# Altium schematic sheet RPE_Schematic.SchDoc
size A4; SheetNumber: 1; SheetTotal: 1
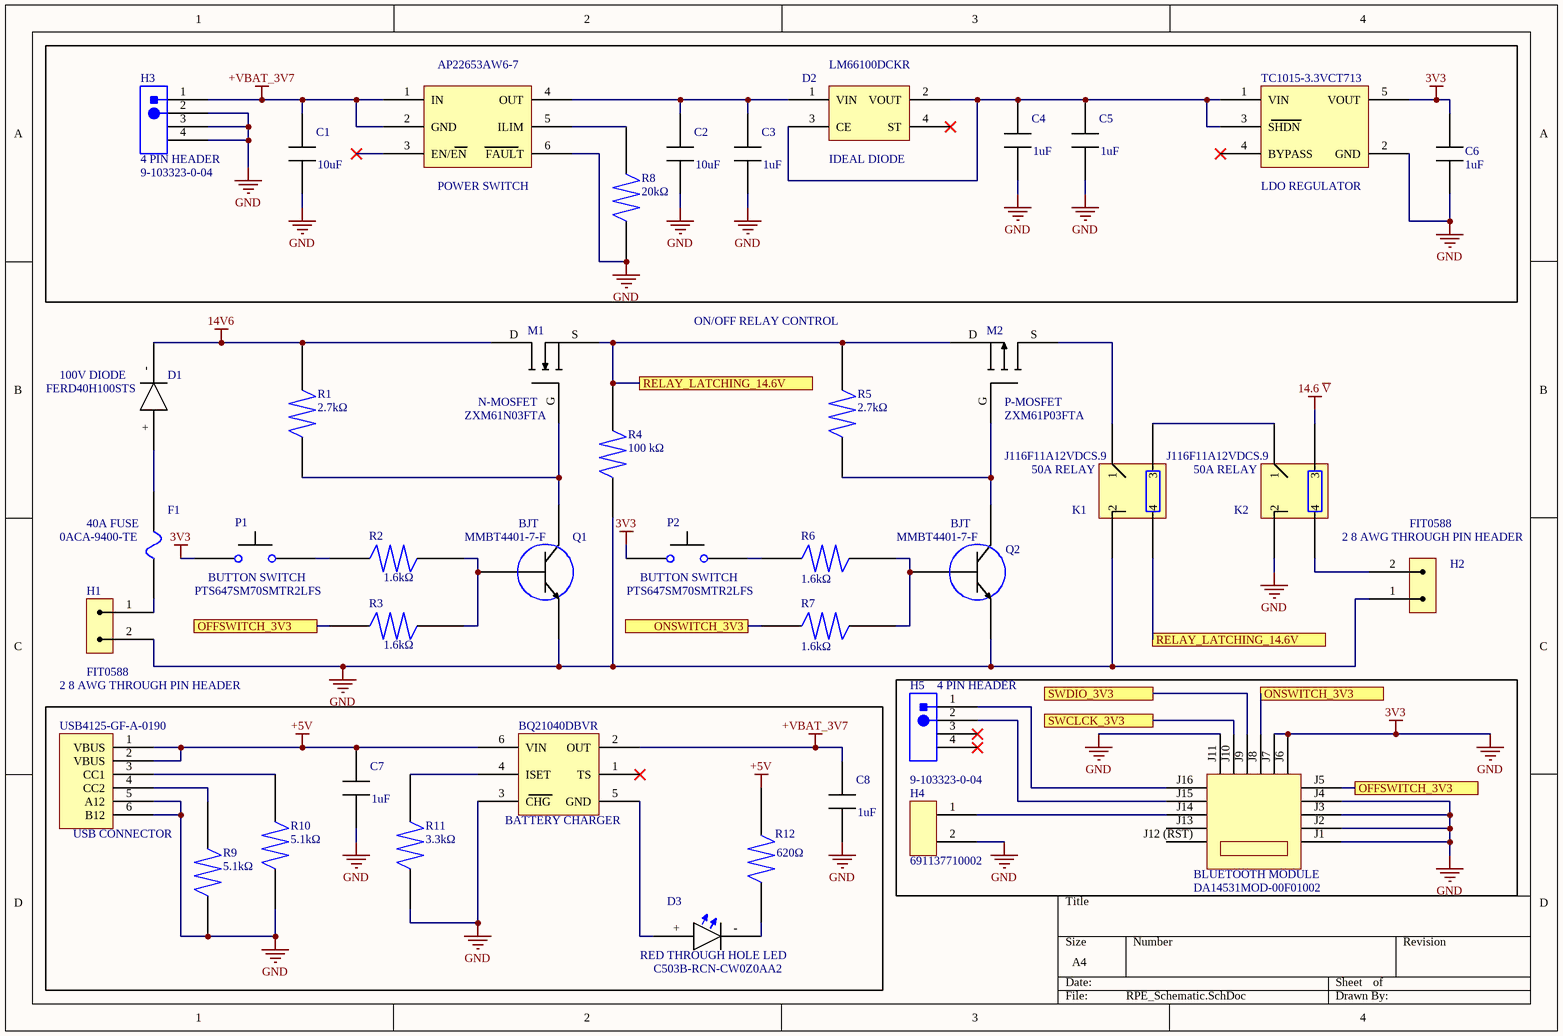
[diagram p0: RPE_Schematic.SchDoc]

## Parts
*  POWER SWITCH
BC  BATTERY CHARGER
BT  BLUETOOTH MODULE
C1  value 10uF  (hidden comment: GRM188D71A106MA73J)
C2  value 10uF  (hidden comment: GRM188D71A106MA73J)
C3  value 1uF  (hidden comment: 1 uF Capacitor)
C4  value 1uF  (hidden comment: 1 uF Capacitor)
C5  value 1uF  (hidden comment: 1 uF Capacitor)
C6  value 1uF  (hidden comment: 1 uF Capacitor)
C7  value 1uF  (hidden comment: 1 uF Capacitor)
C8  value 1uF  (hidden comment: 1 uF Capacitor)
D1  100V DIODE
D2  IDEAL DIODE
D3  RED THROUGH HOLE LED
F1  40A FUSE
H1  2 8 AWG THROUGH PIN HEADER
H2  2 8 AWG THROUGH PIN HEADER
H3  4 PIN HEADER
H4  691137710002
H5  4 PIN HEADER
K1  50A RELAY
K2  50A RELAY
LDO  LDO REGULATOR
M1  N-MOSFET
M2  P-MOSFET
P1  BUTTON SWITCH
P2  BUTTON SWITCH
Q1  BJT
Q2  BJT
R1  value 2.7kΩ  (hidden comment: CR0603-FX-2701ELF)
R2  value 1.6kΩ  (hidden comment: SG73P1JTTD1601F)
R3  value 1.6kΩ  (hidden comment: SG73P1JTTD1601F)
R4  100 kΩ
R5  value 2.7kΩ  (hidden comment: CR0603-FX-2701ELF)
R6  value 1.6kΩ  (hidden comment: SG73P1JTTD1601F)
R7  value 1.6kΩ  (hidden comment: SG73P1JTTD1601F)
R8  value 20kΩ  (hidden comment: NRC06F2002TRF)
R9  value 5.1kΩ  (hidden comment: RC0402FR-135K1L)
R10  value 5.1kΩ  (hidden comment: RC0402FR-135K1L)
R11  value 3.3kΩ  (hidden comment: Chip Resistor)
R12  value 620Ω  (hidden comment: RMCF0603FT620R)
U1  USB CONNECTOR

## Ports
OFFSWITCH_3V3 (see RPE_Schematic(Needs more slay)[1C]), OFFSWITCH_3V3 (see RPE_Schematic(Needs more slay)[4D]), ONSWITCH_3V3 (see RPE_Schematic(Needs more slay)[2C]), ONSWITCH_3V3 (see RPE_Schematic(Needs more slay)[4C]), RELAY_LATCHING_14.6V (see RPE_Schematic(Needs more slay)[2B]), RELAY_LATCHING_14.6V (see RPE_Schematic(Needs more slay)[3C]), SWCLCK_3V3, SWDIO_3V3

## Nets
3V3: *.6(FAULT) BC.3(CHG) BT.J1 BT.J2 BT.J3 BT.J4 BT.J6 BT.J7 BT.J11 C1.1 C2.1 C3.1 C4.1 C5.1 C6.1 C6.2 C7.1 C8.1 H1.2 H2.1 H3.2 H3.3 H3.4 H4.2 K1.?2(2) K2.?2(2) LDO.2(GND) LDO.5(VOUT) P1.?1 P2.?1 Q1.?3 Q2.?3 R4.1 R8.1 R9.1 R10.1 R11.1 U1.5(A12) U1.6(B12)  [also labelled GND]
14.6 ~{V}: K2.?4(3)
14V6: D1.- M1.D R1.?1
+5V: BC.6(VIN) C7.2 R12.2 U1.1(VBUS) U1.2(VBUS)
+VBAT_3V7: *.1(IN) *.2(GND) BC.2(OUT) C1.2 C8.2 H3.1
OFFSWITCH_3V3: BT.J5 R3.1 ; port OFFSWITCH_3V3
ONSWITCH_3V3: BT.J8 R7.1 ; port ONSWITCH_3V3
RELAY_LATCHING_14.6V: K1.?3(4) M1.S M2.D R4.?1 R5.?1 ; port RELAY_LATCHING_14.6V
SWCLCK_3V3: BT.J10 ; port SWCLCK_3V3
SWDIO_3V3: BT.J9 ; port SWDIO_3V3
Net*_4: *.4(OUT) C2.2 C3.2 D2.1(VIN)
Net*_5: *.5(ILIM) R8.2
NetBC_4: BC.4(ISET) R11.2
NetBC_5: BC.5(GND) D3.+
NetBT_J14: BT.J14 H4.1
NetBT_J15: BT.J15 H5.2
NetBT_J16: BT.J16 H5.1
NetC4_2: C4.2 C5.2 D2.2(VOUT) D2.3(CE) LDO.1(VIN) LDO.3(SHDN)
NetD1_+: D1.+ F1.?2
NetD3_-: D3.- R12.1
NetF1_?1: F1.?1 H1.1
NetH2_2: H2.2 K2.?3(4)
NetK1_?1: K1.?1(1) M2.S
NetK1_?4: K1.?4(3) K2.?1(1)
NetM1_G: M1.G Q1.?2 R1.1
NetM2_G: M2.G Q2.?2 R5.1
NetP1_?2: P1.?2 R2.1
NetP2_?2: P2.?2 R6.1
NetQ1_?1: Q1.?1 R2.?1 R3.?1
NetQ2_?1: Q2.?1 R6.?1 R7.?1
NetR9_2: R9.2 U1.4(CC2)
NetR10_2: R10.2 U1.3(CC1)

Not connected (* = marked no-connect by the designer): * 3(EN/EN)*; BC 1(TS)*; BT J12 (RST) J13; D2 4(ST)*; H5 3* 4*; LDO 4(BYPASS)*

## Notes on the sheet
- ON/OFF RELAY CONTROL

## Library data of the parts
* = AP22653AW6-7: PRECISION ADJUSTABLE CURRENT-LIMITED POWER SWITCHES, -40 to 85°C pF, RoHS; Manufacturer: Diodes; Number of Channels: 1NUMBER; Supplier: Digikey; Supplier Part Number: 31-AP22653AW6-7CT-ND; RoHS: Yes; Category: USB Interface ICs; Stock: 404154; Pricing: 1=0.44, 10=0.378, 25=0.3524, 100=0.282, 250=0.2618, 500=0.22154, 1000=0.17118 (USD); ComponentLink1URL: https://www.diodes.com/assets/Datasheets/AP22652_53_52A_53A.pdf?src-supplier=Digikey; ComponentLink1Description: https://www.diodes.com/assets/Datasheets/AP22652_53_52A_53A.pdf?src-supplier=Digikey; Manufacturer Part Number: AP22653AW6-7
BC = BQ21040DBVR: IC BAT CHG LI-ION 1 CELL SOT23-6; Manufacturer: Texas Instruments; Number of Cells: 1; Fault Protection: Over Voltage,Over Temperature,Short Circuit; Interface: USB; Max Charge Current: 800mA; Battery Pack Voltage: 4.2V; Max Supply Voltage: 6.45V; Supplier: Digikey; Supplier Part Number: 296-47315-6-ND; RoHS: Yes; Category: Battery Management; Stock: 1140; Pricing: 1=0.89, 10=0.78, 25=0.7328, 100=0.5979, 250=0.5554, 500=0.47268, 1000=0.37814 (USD); Mounting Technology: Surface Mount; Case/Package: SOT-23-6; Min Operating Temperature: 0°C; Max Operating Temperature: 125°C; Packaging: Cut Tape; Series: -; Lead Free: Lead Free; RoHS Compliant: Yes; ComponentLink1URL: http://www.ti.com/lit/ds/symlink/bq21040.pdf?src-supplier=Digikey; ComponentLink1Description: http://www.ti.com/lit/ds/symlink/bq21040.pdf?src-supplier=Digikey; ComponentLink2URL: http://www.ti.com/general/docs/suppproductinfo.tsp?distId=10&gotoUrl=http%3A%2F%2Fwww.ti.com%2Flit%2Fgpn%2Fbq21040&src-supplier=Digikey; ComponentLink2Description: http://www.ti.com/general/docs/suppproductinfo.tsp?distId=10&gotoUrl=http%3A%2F%2Fwww.ti.com%2Flit%2Fgpn%2Fbq21040&src-supplier=Digikey; ComponentLink3URL: http://www.ti.com/general/docs/suppproductinfo.tsp?distId=10&amp;gotoUrl=http%3A%2F%2Fwww.ti.com%2Flit%2Fgpn%2Fbq21040&src-supplier=Digikey; ComponentLink3Description: http://www.ti.com/general/docs/suppproductinfo.tsp?distId=10&amp;gotoUrl=http%3A%2F%2Fwww.ti.com%2Flit%2Fgpn%2Fbq21040&src-supplier=Digikey; Manufacturer Part Number: BQ21040DBVR
BT = DA14531MOD-00F01002: Bluetooth Module, 1MBPS, Bluetooth 5.1 Rohs Compliant: Yes; Manufacturer: Renesas; Supplier: Digikey; Supplier Part Number: 1695-DA14531MOD-00F01002CT-ND; RoHS: No; Category: RF Receivers, Transceivers; Stock: 218621; Pricing: 1=5.66, 10=5.05, 25=4.5448, 100=4.141, 250=3.737, 500=3.3532 (USD); ComponentLink1URL: https://datasheet.octopart.com/DA14531MOD-00F01002-Dialog-Semiconductor-datasheet-153441348.pdf?src-supplier=Farnell; ComponentLink1Description: https://datasheet.octopart.com/DA14531MOD-00F01002-Dialog-Semiconductor-datasheet-153441348.pdf?src-supplier=Farnell; ComponentLink2URL: https://datasheet.octopart.com/DA14531MOD-00F01002-Renesas-datasheet-169923465.pdf?src-supplier=Future+Electronics; ComponentLink2Description: https://datasheet.octopart.com/DA14531MOD-00F01002-Renesas-datasheet-169923465.pdf?src-supplier=Future+Electronics; Manufacturer Part Number: DA14531MOD-00F01002
C1 C2 = GRM188D71A106MA73J: Cap 10UF 10VDC X7T 20% SMD 0603 Paper Tape; Manufacturer: Murata; Voltage Rating: 10V; Supplier: Digikey; Supplier Part Number: 490-GRM188D71A106MA73JCT-ND; Manufacturer Part Number: GRM188D71A106MA73J; RoHS: Yes; Category: Ceramic Capacitors; Stock: 9799; Pricing: 1=0.3, 10=0.197, 50=0.145, 100=0.118, 500=0.09316, 1000=0.07867, 2500=0.07453, 5000=0.07039 (USD); Mounting Technology: Surface Mount; Case/Package: 0603; Weight: 0.000222oz; Min Operating Temperature: -55°C; Max Operating Temperature: 125°C; Packaging: Tape and Reel; Tolerance: 20%; Package Quantity: 10000; Dielectric: X7T; Voltage Rating (DC): 10V; Series: GRM; RoHS Compliant: Yes; ComponentLink1URL: http://www.mouser.com/ds/2/281/c02e-2905.pdf?src-supplier=Mouser; ComponentLink1Description: http://www.mouser.com/ds/2/281/c02e-2905.pdf?src-supplier=Mouser; ComponentLink2URL: http://search.murata.co.jp/Ceramy/image/img/A01X/partnumbering_e_01.pdf?src-supplier=Digikey; ComponentLink2Description: http://search.murata.co.jp/Ceramy/image/img/A01X/partnumbering_e_01.pdf?src-supplier=Digikey
C3-C8 = CL10B105MO8NNWC: SMD Multilayer Ceramic Capacitor, 1 µF, 16 V, 0603 [1608 Metric], ± 20%, X7R, CL Series; Manufacturer: Samsung; Material: 4241ConductorMaterial; Voltage Rating: 16V; Dielectric: 1511DielectricType; Supplier: Digikey; Supplier Part Number: 1276-6524-1-ND; Manufacturer Part Number: CL10B105MO8NNWC; RoHS: Yes; Category: Ceramic Capacitors; Stock: 1284189; Pricing: 1=0.1, 10=0.034, 50=0.0196, 100=0.0152, 500=0.01142, 1000=0.00897 (USD); Mounting Technology: Surface Mount; Case/Package: 0603; Case Code (Metric): 1608; Case Code (Imperial): 0603; Min Operating Temperature: -55°C; Max Operating Temperature: 125°C; Packaging: Cut Tape; Tolerance: 20%; Series: CL; Voltage Rating (DC): 16V; Length: 0.063inch; Width: 0.031inch; Height: 900um; Thickness: 0.035inch; RoHS Compliant: Yes; ComponentLink1URL: https://media.digikey.com/pdf/Data%20Sheets/Samsung%20PDFs/CL10B105MO8NNWC.pdf?src-supplier=Digikey; ComponentLink1Description: https://media.digikey.com/pdf/Data%20Sheets/Samsung%20PDFs/CL10B105MO8NNWC.pdf?src-supplier=Digikey; ComponentLink2URL: http://www.farnell.com/datasheets/2710574.pdf?src-supplier=Farnell; ComponentLink2Description: http://www.farnell.com/datasheets/2710574.pdf?src-supplier=Farnell; ComponentLink3URL: https://datasheet.octopart.com/CL10B105MO8NNWC-Samsung-Electro-Mechanics-datasheet-120079234.pdf?src-supplier=Future+Electronics; ComponentLink3Description: https://datasheet.octopart.com/CL10B105MO8NNWC-Samsung-Electro-Mechanics-datasheet-120079234.pdf?src-supplier=Future+Electronics; ComponentLink4URL: http://www.farnell.com/datasheets/2710574.pdf?src-supplier=Newark; ComponentLink4Description: http://www.farnell.com/datasheets/2710574.pdf?src-supplier=Newark; ComponentLink5URL: http://www.farnell.com/datasheets/2710574.pdf?src-supplier=Element14; ComponentLink5Description: http://www.farnell.com/datasheets/2710574.pdf?src-supplier=Element14
D1 = FERD40H100STS: FERD40H100 Series 100 V 40 A Field Effect Rectifier Diode - TO-220AB; Manufacturer: STMicroelectronics; Average Rectified Current: 40A; Supplier: Digikey; Supplier Part Number: 497-16954-ND; RoHS: Yes; Category: Rectifier Diodes; Stock: 1657; Pricing: 1=1.4, 50=1.1266, 100=0.8927, 500=0.7567, 1000=0.61641, 2000=0.58028, 5000=0.55264, 10000=0.52714 (USD); Mounting Technology: Through Hole; Case/Package: TO-220-3; Packaging: Rail/Tube; Max Reverse Voltage (DC): 100V; Series: -; Diode Type: RECTIFIER; RoHS Compliant: Yes; ComponentLink1URL: http://www.st.com/content/ccc/resource/technical/document/datasheet/group3/4e/b5/b8/47/b6/af/41/d6/DM00281757/files/DM00281757.pdf/jcr:content/translations/en.DM00281757.pdf?src-supplier=Digikey; ComponentLink1Description: http://www.st.com/content/ccc/resource/technical/document/datasheet/group3/4e/b5/b8/47/b6/af/41/d6/DM00281757/files/DM00281757.pdf/jcr:content/translations/en.DM00281757.pdf?src-supplier=Digikey; ComponentLink2URL: https://datasheet.octopart.com/FERD40H100STS-STMicroelectronics-datasheet-62332851.pdf?src-supplier=Future+Electronics; ComponentLink2Description: https://datasheet.octopart.com/FERD40H100STS-STMicroelectronics-datasheet-62332851.pdf?src-supplier=Future+Electronics; ComponentLink3URL: https://datasheet.octopart.com/FERD40H100STS-STMicroelectronics-datasheet-141402762.pdf?src-supplier=TME; ComponentLink3Description: https://datasheet.octopart.com/FERD40H100STS-STMicroelectronics-datasheet-141402762.pdf?src-supplier=TME; Manufacturer Part Number: FERD40H100STS
D2 = LM66100DCKR: 1.5-V to 5.5-V, 1.5-A, 0.5-uA IQ ideal diode with Integrated FET 6-SC70 -40 to 105; Manufacturer: Texas Instruments; Max Output current: 1.5A; Turn-On Delay Time: 27us; Turn-Off Delay Time: 2us; Supplier: Digikey; Supplier Part Number: 296-53541-1-ND; RoHS: Yes; Category: Integrated Circuits (ICs); Stock: 1921; Pricing: 1=0.41, 10=0.332, 25=0.304, 100=0.2262, 250=0.20504, 500=0.16968, 1000=0.12726 (USD); Mounting Technology: Surface Mount; Min Operating Temperature: -40°C; Max Operating Temperature: 105°C; Series: -; ComponentLink1URL: http://www.ti.com/general/docs/suppproductinfo.tsp?distId=10&amp;gotoUrl=http%3A%2F%2Fwww.ti.com%2Flit%2Fgpn%2flm66100&src-supplier=Digikey; ComponentLink1Description: http://www.ti.com/general/docs/suppproductinfo.tsp?distId=10&amp;gotoUrl=http%3A%2F%2Fwww.ti.com%2Flit%2Fgpn%2flm66100&src-supplier=Digikey; Manufacturer Part Number: LM66100DCKR
D3 = C503B-RCN-CW0Z0AA2: CREE - C503B-RCN-CW0Z0AA2 - LED, Red, Through Hole, T-1 3/4 (5mm), 20 mA, 2.1 V, 624 nm; Lens Color: Colorless; Luminous Intensity: 7500mcd; Viewing Angle: 30°; Forward Voltage: 2.1V; Wavelength: 624nm; Forward Current: 20mA; Lens Style: Dome,Elliptical,Round; Lens Transparency: Clear; Number of LEDs: 1; Supplier: Digikey; Supplier Part Number: C503B-RCN-CW0Z0AA2CT-ND; Manufacturer: Cree; RoHS: Yes; Category: LEDs; Stock: 49819; Pricing: 1=0.18, 10=0.167, 100=0.1548, 1000=0.139 (USD); Mounting Technology: Through Hole; Case/Package: Radial; Pins: 5; Color: Red; Min Operating Temperature: -40°C; Max Operating Temperature: 100°C; Illumination Color: Red; Package Quantity: 2500; Packaging: Cut Tape; Test Current: 20mA; Dominant Wavelength: 624nm; Series: -; Height: 10.3mm; RoHS Compliant: Yes; Reach SVHC Compliant: Unknown; ComponentLink1URL: https://datasheet.ciiva.com/8076/c503brasranaasaanrbsrbnabsabnrcsrcnacsacn1079-8076255.pdf?src-supplier=Element14; ComponentLink1Description: https://datasheet.ciiva.com/8076/c503brasranaasaanrbsrbnabsabnrcsrcnacsacn1079-8076255.pdf?src-supplier=Element14; ComponentLink2URL: https://datasheet.ciiva.com/46396/1783695-46396283.pdf?src-supplier=Element14; ComponentLink2Description: https://datasheet.ciiva.com/46396/1783695-46396283.pdf?src-supplier=Element14; ComponentLink3URL: https://datasheet.ciiva.com/2116/c503brasranaasaanrbsrbnabsabnrcsrcnacsacn1079-2116093.pdf?src-supplier=Digikey; ComponentLink3Description: https://datasheet.ciiva.com/2116/c503brasranaasaanrbsrbnabsabnrcsrcnacsacn1079-2116093.pdf?src-supplier=Digikey; Manufacturer Part Number: C503B-RCN-CW0Z0AA2
F1 = 0ACA-9400-TE: Bel Fuse, Internal Part #: 0ACA-9400-TE; Supplier: Digikey; Supplier Part Number: 507-0ACA-9400-TECT-ND; Manufacturer: Bel; RoHS: Yes; Category: Fuses; Stock: 695; Pricing: 1=1.32, 5=1.282, 10=1.199, 50=0.9926, 100=0.8272, 250=0.80652, 500=0.68244 (USD); Manufacturer Part Number: 0ACA-9400-TE
H1 H2 = FIT0588: High Quality Gold Plated Male and Female Bullet Connector; Manufacturer: DFRobot; Supplier: Digikey; Supplier Part Number: 1738-1438-ND; RoHS: No; Category: LDO; Stock: 1280; Pricing: 1=3.9 (USD); ComponentLink1URL: https://media.digikey.com/pdf/Data%20Sheets/DFRobot%20PDFs/FIT0588_Web.pdf?src-supplier=Digikey; ComponentLink1Description: https://media.digikey.com/pdf/Data%20Sheets/DFRobot%20PDFs/FIT0588_Web.pdf?src-supplier=Digikey; Manufacturer Part Number: FIT0588
H3 H5 = 9-103323-0-04: CONN HEADR BRKWAY .100 04POS R/A; Manufacturer: TE Connectivity; Number of Positions: 4; Gender: Male; Supplier: Digikey; Supplier Part Number: A32705-04-ND; RoHS: Yes; Category: Connectors; Stock: 9773; Pricing: 1=0.69, 10=0.672, 100=0.5422, 500=0.4801, 1000=0.4208, 5000=0.36714, 10000=0.34172 (USD); Mounting Technology: Through Hole; Case/Package: 100; Housing Color: Black; Contact Material: Copper Alloy; Housing Material: Plastic; Contact Shape: Square; Contact Finish - Mating: TIN; Insulation Material: Thermoplastic; Insulation Color: Black; Min Operating Temperature: -65°C; Max Operating Temperature: 105°C; Number of Rows: 1; Packaging: Bulk; Termination: Solder; Number of Contacts: 4; Series: AMPMODU MOD II; Contact Type: Male Pin; Fastening Type: Pull; Length: 9.75mm; Width: 2.29mm; Height: 3.5mm; Lead Free: Lead Free; Flammability Rating: UL94 V-0; ComponentLink1URL: http://www.te.com/commerce/DocumentDelivery/DDEController?Action=srchrtrv&DocNm=103323&DocType=Customer+Drawing&DocLang=English&src-supplier=Digikey; ComponentLink1Description: http://www.te.com/commerce/DocumentDelivery/DDEController?Action=srchrtrv&DocNm=103323&DocType=Customer+Drawing&DocLang=English&src-supplier=Digikey; Manufacturer Part Number: 9-103323-0-04
H4 = 691137710002: Series 1377 - 5.00 mm Horizontal Entry with Pressure Clamp WR-TBL, 2 pin; Manufacturer: Wurth Electronics; Plating: Copper Alloy,ZINC PLATED; Number of Levels: 1; Number of Positions Per Level: 2; Current: 16A; Voltage: 300V; Number of Contacts: 2NUMBER; Wire Gauge (Max): 30AWG; Wire Gauge (Min): 12AWG; Supplier: Digikey; Supplier Part Number: 732-10955-ND; RoHS: Yes; Category: Terminal Blocks; Stock: 5754; Pricing: 1=0.41, 10=0.363, 50=0.32, 100=0.287, 500=0.277 (USD); Mounting Technology: Through Hole; Pins: 2NUMBER; Color: Green; Housing Material: PC; Contact Material: 153,154ConductorMaterial; Min Operating Temperature: -30°C; Max Operating Temperature: 120°C; Termination: Screw; Series: WR-TBL Series 1377; Current Rating: 16A; Number of Rows: 1NUMBER; Voltage Rating: 300V; Height: 11.6mm; Lead Pitch: 5mm; RoHS Compliant: Yes; ComponentLink1URL: https://katalog.we-online.de/em/datasheet/691137710002.pdf?src-supplier=Digikey; ComponentLink1Description: https://katalog.we-online.de/em/datasheet/691137710002.pdf?src-supplier=Digikey; Manufacturer Part Number: 691137710002
K1 K2 = J116F11A12VDCS.9: Relay Gen Purpose SPST 50A 12V; Manufacturer: CIT Relay & Switch; Supplier: Digikey; Supplier Part Number: 2449-J116F11A12VDCS.9-ND; RoHS: No; Category: Power Relays; Stock: 434; Pricing: 1=3.35, 15=3.136, 30=2.78767, 60=2.64817, 105=2.50886, 255=2.23008, 510=2.09071, 1005=1.95132, 5010=1.88163 (USD); Manufacturer Part Number: J116F11A12VDCS.9
LDO = TC1015-3.3VCT713: TC1015 Series 100 mA 3.3 V Fixed Output LDO Regulator w/ Shutdown - SOT-23-5; Manufacturer: Microchip; Min Input Voltage: 2.7V; Max Supply Voltage: 6V; Output Voltage: 3.3V; Number of Outputs: 1; Polarity: Positive; Accuracy: 2.5%; Max Output current: 100mA; Dropout Voltage: 180mV; Quiescent Current: 80uA; Power Supply Rejection Ratio (PSRR): 64dB; Number of Channels: 1NUMBER; Supplier: Digikey; Supplier Part Number: TC1015-3.3VCT713CT-ND; RoHS: Yes; Category: Voltage Regulators - Linear; Stock: 23325; Pricing: 1=0.49, 25=0.41, 100=0.36 (USD); Mounting Technology: Surface Mount; Case/Package: SOT-23; Pins: 5; Min Operating Temperature: -40°C; Max Operating Temperature: 125°C; Packaging: Tape and Reel; Output Type: Fixed; Series: -; Package Quantity: 3000; Output Current: 100mA; Number of Regulators: 1; Termination: SMD/SMT; Current Rating: 100mA; Min Supply Voltage: 2.7V; Nominal Output Voltage: 3.3V; Min Output Voltage: 3.3V; Max Output Voltage: 3.3V; Output Configuration: Positive; Length: 3.1mm; Width: 1.8mm; Height: 1.3mm; Radiation Hardening: No; RoHS Compliant: Yes; Reach SVHC Compliant: No; Lead Free: Lead Free; ComponentLink1URL: https://datasheet.ciiva.com/41463/001085540-da-01-en-ic-reg-ldo-tc1015-3-3vct713-sot-23-5-mcp-41463228.pdf?src-supplier=Conrad; ComponentLink1Description: https://datasheet.ciiva.com/41463/001085540-da-01-en-ic-reg-ldo-tc1015-3-3vct713-sot-23-5-mcp-41463228.pdf?src-supplier=Conrad; ComponentLink2URL: https://datasheet.ciiva.com/8238/jp011417-8238485.pdf?src-supplier=Avnet; ComponentLink2Description: https://datasheet.ciiva.com/8238/jp011417-8238485.pdf?src-supplier=Avnet; ComponentLink3URL: https://datasheet.ciiva.com/2040/filehandler-aspxddocname-en026002-2040022.pdf?src-supplier=Digikey; ComponentLink3Description: https://datasheet.ciiva.com/2040/filehandler-aspxddocname-en026002-2040022.pdf?src-supplier=Digikey; ComponentLink4URL: https://datasheet.ciiva.com/2040/filehandler-aspxddocname-en026002-2040023.pdf?src-supplier=Digikey; ComponentLink4Description: https://datasheet.ciiva.com/2040/filehandler-aspxddocname-en026002-2040023.pdf?src-supplier=Digikey; ComponentLink5URL: https://datasheet.ciiva.com/2040/filehandler-aspxddocname-en026002-2040024.pdf?src-supplier=Digikey; ComponentLink5Description: https://datasheet.ciiva.com/2040/filehandler-aspxddocname-en026002-2040024.pdf?src-supplier=Digikey; ComponentLink6URL: https://datasheet.ciiva.com/2075/21335e-2075754.pdf?src-supplier=Digikey; ComponentLink6Description: https://datasheet.ciiva.com/2075/21335e-2075754.pdf?src-supplier=Digikey; ComponentLink7URL: https://datasheet.ciiva.com/14562/70046349-14562758.pdf?src-supplier=Allied+Electronics; ComponentLink7Description: https://datasheet.ciiva.com/14562/70046349-14562758.pdf?src-supplier=Allied+Electronics; ComponentLink8URL: https://datasheet.ciiva.com/22711/82112-22711035.pdf?src-supplier=Element14; ComponentLink8Description: https://datasheet.ciiva.com/22711/82112-22711035.pdf?src-supplier=Element14; ComponentLink9URL: https://datasheet.ciiva.com/8041/21335e-8041544.pdf?src-supplier=Element14; ComponentLink9Description: https://datasheet.ciiva.com/8041/21335e-8041544.pdf?src-supplier=Element14; Manufacturer Part Number: TC1015-3.3VCT713
M1 = ZXM61N03FTA: N-Channel 30V 1.4A (Ta) 625mW (Ta) Surface Mount SOT-23-3; Manufacturer: Diodes Zetex; Rise Time: 2.5ns; Gate to Source Voltage (Vgs): 20V; Turn-Off Delay Time: 5.8ns; Turn-On Delay Time: 1.9ns; Rds On Max: 220mR; Input Capacitance: 150pF; Nominal Vgs: 1V; Number of Elements: 1; Power Dissipation: 806mW; Current Rating: 1.2A; Supplier: Digikey; Supplier Part Number: ZXM61N03FCT-ND; RoHS: Yes; Category: MOSFETs; Stock: 146742; Pricing: 1=0.46, 10=0.397, 100=0.2757, 500=0.21528, 1000=0.17498 (USD); Mounting Technology: Surface Mount; Case/Package: SOT-23; Pins: 3; Weight: 0.000282oz; Min Operating Temperature: -55°C; Max Operating Temperature: 150°C; Fall Time: 2.5ns; Package Quantity: 3000; Packaging: Tape and Reel; Max Power Dissipation: 625mW; Dual Supply Voltage: 30V; Drain to Source Voltage (Vdss): 30V; Continuous Drain Current (ID): 1.4A; Number of Channels: 1; Drain to Source Resistance: 220mR; Termination: SMD/SMT; Voltage Rating (DC): 30V; Polarity: N-CHANNEL; Series: -; Drain-source On Resistance-Max: 220mR; Length: 3.04mm; Width: 1.4mm; Height: 1.02mm; Radiation Hardening: No; Reach SVHC Compliant: No; Lead Free: Lead Free; RoHS Compliant: Yes; ComponentLink1URL: https://datasheet.ciiva.com/11176/zxm61n03f-11176547.pdf?src-supplier=Avnet; ComponentLink1Description: https://datasheet.ciiva.com/11176/zxm61n03f-11176547.pdf?src-supplier=Avnet; ComponentLink2URL: https://datasheet.ciiva.com/935/zxm61n03f-935122.pdf?src-supplier=Digikey; ComponentLink2Description: https://datasheet.ciiva.com/935/zxm61n03f-935122.pdf?src-supplier=Digikey; ComponentLink3URL: https://datasheet.ciiva.com/5775/1643170-5775147.pdf?src-supplier=Farnell; ComponentLink3Description: https://datasheet.ciiva.com/5775/1643170-5775147.pdf?src-supplier=Farnell; ComponentLink4URL: https://datasheet.ciiva.com/935/zxm61n03f-935123.pdf?src-supplier=Digikey; ComponentLink4Description: https://datasheet.ciiva.com/935/zxm61n03f-935123.pdf?src-supplier=Digikey; ComponentLink5URL: https://datasheet.ciiva.com/935/zxm61n03f-935124.pdf?src-supplier=Digikey; ComponentLink5Description: https://datasheet.ciiva.com/935/zxm61n03f-935124.pdf?src-supplier=Digikey; ComponentLink6URL: https://datasheet.ciiva.com/8024/1643170-8024088.pdf?src-supplier=Element14; ComponentLink6Description: https://datasheet.ciiva.com/8024/1643170-8024088.pdf?src-supplier=Element14; Manufacturer Part Number: ZXM61N03FTA
M2 = ZXM61P03FTA: ZXM61P03F 30 V 0.35 Ohm P-Channel Enhancement Mode Vertical DMOS FET - SOT-23; Manufacturer: Diodes Zetex; Rise Time: 2.9ns; Gate to Source Voltage (Vgs): 20V; Turn-Off Delay Time: 8.9ns; Turn-On Delay Time: 1.9ns; Nominal Vgs: -1V; Max Power Dissipation: 625mW; Rds On Max: 350mR; Input Capacitance: 140pF; Number of Elements: 1; Dual Supply Voltage: -30V; Drain to Source Voltage (Vdss): 30V; Continuous Drain Current (ID): 1.1A; Drain to Source Resistance: 550mR; Power Dissipation: 806mW; Current Rating: -1.1A; Supplier: Digikey; Supplier Part Number: ZXM61P03FCT-ND; RoHS: Yes; Category: MOSFETs; Stock: 104868; Pricing: 1=0.42, 10=0.357, 100=0.2482, 500=0.19376, 1000=0.15748 (USD); Mounting Technology: Surface Mount; Case/Package: SOT-23; Pins: 3; Weight: 0.000282oz; Min Operating Temperature: -55°C; Max Operating Temperature: 150°C; Fall Time: 2.9ns; Packaging: Tape and Reel; Package Quantity: 3000; Number of Channels: 1; Termination: SMD/SMT; Voltage Rating (DC): -30V; Polarity: P-CHANNEL; Series: -; Drain-source On Resistance-Max: 350mR; Length: 3.04mm; Width: 1.4mm; Height: 1.02mm; Radiation Hardening: No; Reach SVHC Compliant: No; Lead Free: Lead Free; RoHS Compliant: Yes; ComponentLink1URL: https://datasheet.ciiva.com/11176/zxm61p03f-11176401.pdf?src-supplier=Avnet; ComponentLink1Description: https://datasheet.ciiva.com/11176/zxm61p03f-11176401.pdf?src-supplier=Avnet; ComponentLink2URL: https://datasheet.ciiva.com/11176/zxm61p03f-11176557.pdf?src-supplier=Avnet; ComponentLink2Description: https://datasheet.ciiva.com/11176/zxm61p03f-11176557.pdf?src-supplier=Avnet; ComponentLink3URL: https://datasheet.ciiva.com/935/zxm61p03f-935140.pdf?src-supplier=Digikey; ComponentLink3Description: https://datasheet.ciiva.com/935/zxm61p03f-935140.pdf?src-supplier=Digikey; ComponentLink4URL: https://datasheet.ciiva.com/935/zxm61p03f-935141.pdf?src-supplier=Digikey; ComponentLink4Description: https://datasheet.ciiva.com/935/zxm61p03f-935141.pdf?src-supplier=Digikey; ComponentLink5URL: https://datasheet.ciiva.com/935/zxm61p03f-935142.pdf?src-supplier=Digikey; ComponentLink5Description: https://datasheet.ciiva.com/935/zxm61p03f-935142.pdf?src-supplier=Digikey; ComponentLink6URL: https://datasheet.ciiva.com/4443/zxm61p03f-4443147.pdf?src-supplier=Mouser; ComponentLink6Description: https://datasheet.ciiva.com/4443/zxm61p03f-4443147.pdf?src-supplier=Mouser; ComponentLink7URL: https://datasheet.ciiva.com/16216/zxm61p03f-16216056.pdf?src-supplier=Future+Electronics; ComponentLink7Description: https://datasheet.ciiva.com/16216/zxm61p03f-16216056.pdf?src-supplier=Future+Electronics; Manufacturer Part Number: ZXM61P03FTA
P1 P2 = PTS647SM70SMTR2LFS: Switch Tactile N.O. SPST Round Button Gull Wing 0.05A 12VDC 100000Cycles 1.77N SMD T/R; Manufacturer: ITT C&K; Illumination Type: Non-Illuminated; Switch Function: Off-Mom; Actuator Type: Standard; Operating Force: 180gf; Switch Travel: 0.25mm; Ratings: IP40; Supplier: Digikey; Supplier Part Number: PTS647SM70SMTR2LFSCT-ND; RoHS: No; Category: Tactile Switches; Stock: 62901; Pricing: 1=0.26, 10=0.249, 25=0.236, 100=0.2138, 250=0.19488, 500=0.18114 (USD); Mounting Technology: Surface Mount; Mechanical Life: 100000Cycles; Min Operating Temperature: -20°C; Max Operating Temperature: 70°C; Throw Configuration: SPST; Packaging: Cut Tape; Termination: Gull Wing; Series: PTS647; ComponentLink1URL: https://www.ckswitches.com/media/2567/pts647.pdf?src-supplier=Digikey; ComponentLink1Description: https://www.ckswitches.com/media/2567/pts647.pdf?src-supplier=Digikey; Manufacturer Part Number: PTS647SM70SMTR2LFS
Q1 Q2 = MMBT4401-7-F: Bipolar Transistors - 40V NPN SMALL SIGNAL TRANSISTOR IN SOT23 package; Manufacturer: Diodes Zetex; Max Power Dissipation: 310mW; Frequency: 250MHz; Max Collector Current: 600mA; Collector Base Voltage (VCBO): 60V; Number of Elements: 1; Emitter Base Voltage (VEBO): 6V; Collector-emitter Voltage-Max: 750mV; Supplier: Digikey; Supplier Part Number: MMBT4401-7-F-ND; RoHS: Yes; Category: BJTs; Pricing: 10000=0.01919, 30000=0.01775, 50000=0.01535, 100000=0.01439, 250000=0.01276 (USD); Mounting Technology: Surface Mount; Case/Package: SOT-23; Pins: 3; Min Operating Temperature: -55°C; Max Operating Temperature: 150°C; Packaging: Tape and Reel; Collector Emitter Voltage (VCEO): 40V; Transition Frequency: 250MHz; Polarity: NPN; Power Dissipation: 310mW; Collector Emitter Breakdown Voltage: 40V; Series: Automotive, AEC-Q101; Clock Frequency: 250MHz; Radiation Hardening: No; Reach SVHC Compliant: No; RoHS Compliant: Yes; ComponentLink1URL: https://datasheet.ciiva.com/15139/getdatasheetpartid-234007-15139792.pdf?src-supplier=Verical; ComponentLink1Description: https://datasheet.ciiva.com/15139/getdatasheetpartid-234007-15139792.pdf?src-supplier=Verical; Manufacturer Part Number: MMBT4401-7-F
R1 R5 = CR0603-FX-2701ELF: SMD Chip Resistor, 2.7 kOhm, ± 1%, 100 mW, 0603 [1608 Metric], Thick Film, General Purpose; Manufacturer: Bourns; Power Rating: 100mW; Voltage Rating: 50V; Temperature Coefficient: 100ppm/°C; Supplier: Digikey; Supplier Part Number: CR0603-FX-2701ELFCT-ND; Manufacturer Part Number: CR0603-FX-2701ELF; RoHS: Yes; Category: Chip SMD Resistors; Stock: 96883; Pricing: 1=0.1, 10=0.015, 50=0.009, 100=0.0075, 500=0.00498, 1000=0.00425 (USD); Mounting Technology: Surface Mount; Case/Package: 0603; Case Code (Imperial): 0603; Case Code (Metric): 1608; Contact Plating: Tin; Min Operating Temperature: -55°C; Max Operating Temperature: 155°C; Tolerance: 1%; Packaging: Tape and Reel; Package Quantity: 5000; Termination: SMD/SMT; Number of Terminations: 2; Max Power Dissipation: 100mW; Features: Moisture Resistant; Series: CR0603; Voltage Rating (DC): 50V; Length: 0.063inch; Width: 0.031inch; Height: 0.022inch; Thickness: 457um; Radiation Hardening: No; RoHS Compliant: Yes; ComponentLink1URL: https://datasheet.ciiva.com/18607/chpreztr-18607957.pdf?src-supplier=Digikey; ComponentLink1Description: https://datasheet.ciiva.com/18607/chpreztr-18607957.pdf?src-supplier=Digikey
R2 R3 R6 R7 = SG73P1JTTD1601F: Res, 1K6, 1%, 0.2W, 0603 Rohs Compliant: Yes; Manufacturer: KOA Speer; Power Rating: 200mW; Voltage Rating: 50V; Temperature Coefficient: 100ppm/°C; Supplier: Digikey; Supplier Part Number: 2019-SG73P1JTTD1601FTR-ND; Manufacturer Part Number: SG73P1JTTD1601F; RoHS: Yes; Category: Chip SMD Resistors; Pricing: 5000=0.01791 (USD); Case/Package: 0603; Pins: 2; Case Code (Imperial): 0603; Case Code (Metric): 1608; Min Operating Temperature: -55°C; Max Operating Temperature: 155°C; Packaging: Tape and Reel; Package Quantity: 5000; Tolerance: 1%; Voltage Rating (DC): 50V; Resistor Type: Thick Film; Termination: SMD/SMT; Series: SG73; Resistance Tolerance: 1%; Length: 1.6mm; Width: 0.8mm; Height: 0.45mm; RoHS Compliant: Yes; Reach SVHC Compliant: Unknown; ComponentLink1URL: https://datasheet.ciiva.com/22640/78338-22640856.pdf?src-supplier=Farnell; ComponentLink1Description: https://datasheet.ciiva.com/22640/78338-22640856.pdf?src-supplier=Farnell
R4 = CR0603FB100KS1
R8 = NRC06F2002TRF: Resistor Thick Film 0603 20k Ohm 1% 1/10 Watt ±100ppm °C Surface Mount Paper Tape and Reel; Manufacturer: NIC Components; Power Rating: 100mW; Temperature Coefficient: 100ppm/°C; Voltage Rating (DC): 50V; Supplier: Avnet; Supplier Part Number: 08AH8491; Manufacturer Part Number: NRC06F2002TRF; RoHS: Yes; Category: Chip SMD Resistors; Stock: 10265; Pricing: 1=0.008 (USD); Mounting Technology: Surface Mount; Case/Package: 0603; Contact Plating: Tin,Matte; Min Operating Temperature: -55°C; Max Operating Temperature: 155°C; Tolerance: 1%; Packaging: Tape and Reel; Technology: THICK FILM; Construction: Rectangular; Length: 1.6mm; Height: 0.45mm; Depth: 0.8mm; Military Standard: Not; RoHS Compliant: Yes; Lead Free: 5697LeadFree; ComponentLink1URL: https://datasheet.ciiva.com/34303/2008065-34303777.pdf?src-supplier=Jameco; ComponentLink1Description: https://datasheet.ciiva.com/34303/2008065-34303777.pdf?src-supplier=Jameco; ComponentLink2URL: https://datasheet.ciiva.com/9157/nrc-9157285.pdf?src-supplier=Avnet; ComponentLink2Description: https://datasheet.ciiva.com/9157/nrc-9157285.pdf?src-supplier=Avnet
R9 R10 = RC0402FR-135K1L: SMD Chip Resistor, 5.1 kOhm, ± 1%, 63 mW, 0402 [1005 Metric], Thick Film, General Purpose; Manufacturer: Yageo; Temperature Coefficient: 100ppm/°C; Power Rating: 62.5mW; Voltage Rating: 50V; Supplier: Digikey; Supplier Part Number: 13-RC0402FR-135K1LCT-ND; Manufacturer Part Number: RC0402FR-135K1L; RoHS: Yes; Category: Chip SMD Resistors; Stock: 259167; Pricing: 1=0.1, 10=0.015, 50=0.0088, 100=0.0073, 500=0.00488, 1000=0.00417, 5000=0.00297, 10000=0.00261 (USD); Case/Package: 0402; Contact Plating: Tin,Matte; Case Code (Imperial): 0402; Case Code (Metric): 1005; Min Operating Temperature: -55°C; Max Operating Temperature: 155°C; Tolerance: 1%; Packaging: Tape and Reel; Termination: SMD/SMT; Series: RC; Length: 1mm; Width: 0.5mm; Height: 0.35mm; RoHS Compliant: Yes; ComponentLink1URL: https://datasheet.ciiva.com/8892/pyu-rc0402-51-rohs-l-6-8892773.pdf?src-supplier=Avnet; ComponentLink1Description: https://datasheet.ciiva.com/8892/pyu-rc0402-51-rohs-l-6-8892773.pdf?src-supplier=Avnet
R11 = RC0603FR-133K3L: SMD Chip Resistor, 3.3 kOhm, ± 1%, 100 mW, 0603 [1608 Metric], Thick Film, General Purpose; Manufacturer: Yageo; Voltage Rating: 50V; Power Rating: 100mW; Temperature Coefficient: 100ppm/°C; Supplier: Digikey; Supplier Part Number: 13-RC0603FR-133K3LCT-ND; Manufacturer Part Number: RC0603FR-133K3L; RoHS: Yes; Category: Chip SMD Resistors; Stock: 52269; Pricing: 1=0.1, 10=0.019, 50=0.0114, 100=0.0094, 500=0.00628, 1000=0.00536, 5000=0.00385, 10000=0.00337 (USD); Case/Package: 0603; Case Code (Imperial): 0603; Case Code (Metric): 1608; Min Operating Temperature: -55°C; Max Operating Temperature: 155°C; Termination: SMD/SMT; Series: RC; Packaging: Tape and Reel; Tolerance: 1%; Length: 1.6mm; Width: 0.8mm; Height: 0.45mm; RoHS Compliant: Yes; Lead Free: 5697LeadFree; ComponentLink1URL: http://www.mouser.com/ds/2/447/RC0603-272842.pdf?src-supplier=Mouser; ComponentLink1Description: http://www.mouser.com/ds/2/447/RC0603-272842.pdf?src-supplier=Mouser; ComponentLink2URL: https://datasheet.octopart.com/RC0603FR-133K3L-Yageo-datasheet-164759695.pdf?src-supplier=Future+Electronics; ComponentLink2Description: https://datasheet.octopart.com/RC0603FR-133K3L-Yageo-datasheet-164759695.pdf?src-supplier=Future+Electronics
R12 = RMCF0603FT620R: Res Thick Film 0603 620 Ohm 1% 1/10W ±100ppm/°C Molded SMD SMD Paper T/R; Manufacturer: Stackpole Electronics; Max Power Dissipation: 100mW; Voltage Rating: 75V; Supplier: Digikey; Supplier Part Number: RMCF0603FT620RCT-ND; Manufacturer Part Number: RMCF0603FT620R; RoHS: Yes; Category: Chip SMD Resistors; Stock: 43996; Pricing: 1=0.1, 10=0.015, 50=0.009, 100=0.0075, 500=0.00498, 1000=0.00425 (USD); Mounting Technology: Surface Mount; Case/Package: 0603; Case Code (Metric): 1608; Case Code (Imperial): 0603; Contact Plating: Tin,Matte; Min Operating Temperature: -55°C; Max Operating Temperature: 155°C; Packaging: Tape and Reel; Tolerance: 1%; Number of Terminations: 2; Temperature Coefficient: 100ppm/°C; Features: Automotive AEC-Q200; Series: RMCF; Length: 0.061inch; Width: 0.031inch; Height: 0.022inch; Ratings: AEC-Q200; Radiation Hardening: No; Lead Free: Lead Free; RoHS Compliant: Yes; ComponentLink1URL: https://www.seielect.com/Catalog/SEI-RMCF_RMCP.pdf?src-supplier=Digikey; ComponentLink1Description: https://www.seielect.com/Catalog/SEI-RMCF_RMCP.pdf?src-supplier=Digikey; ComponentLink2URL: https://www.seielect.com/catalog/SEI-Packaging.pdf?src-supplier=Digikey; ComponentLink2Description: https://www.seielect.com/catalog/SEI-Packaging.pdf?src-supplier=Digikey; ComponentLink3URL: https://www.seielect.com/catalog/SEI-RMCF_RMCP.pdf?src-supplier=Avnet; ComponentLink3Description: https://www.seielect.com/catalog/SEI-RMCF_RMCP.pdf?src-supplier=Avnet
U1 = USB4125-GF-A-0190: USB Connector, 24 Contact(s), Female, Right Angle, Solder Terminal, Locking, Receptacle; Manufacturer: Global Connector Technology; USB Standard: 6108USBStandard; Current Rating: 3A; Number of Contacts: 6NUMBER; Voltage Rating: 20V; Supplier: Newark; Supplier Part Number: 56AJ0230; RoHS: No; Category: USB Connectors; Stock: 2157; Pricing: 1=0.379, 50=0.379, 100=0.347, 250=0.347, 500=0.32, 1000=0.32, 1500=0.32, 3000=0.298 (USD); Contact Material: 157ConductorMaterial; Min Operating Temperature: -30°C; Max Operating Temperature: 85°C; Height: 3.41mm; Manufacturer Part Number: USB4125-GF-A-0190